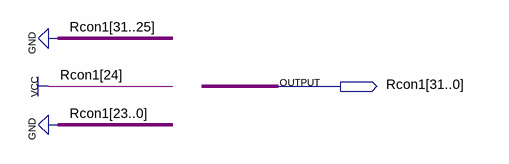
[diagram p0: schematic sheet]
// Quartus schematic Rcon1.bdf as structural Verilog: 0 symbols, 1 pins
module Rcon1 (
  output [31:0] Rcon1
);


  assign Rcon1 = 32'b00000001000000000000000000000000;
endmodule
